# EAGLE board miniPET_final (EAGLE 9.6.2), part 1 of 2
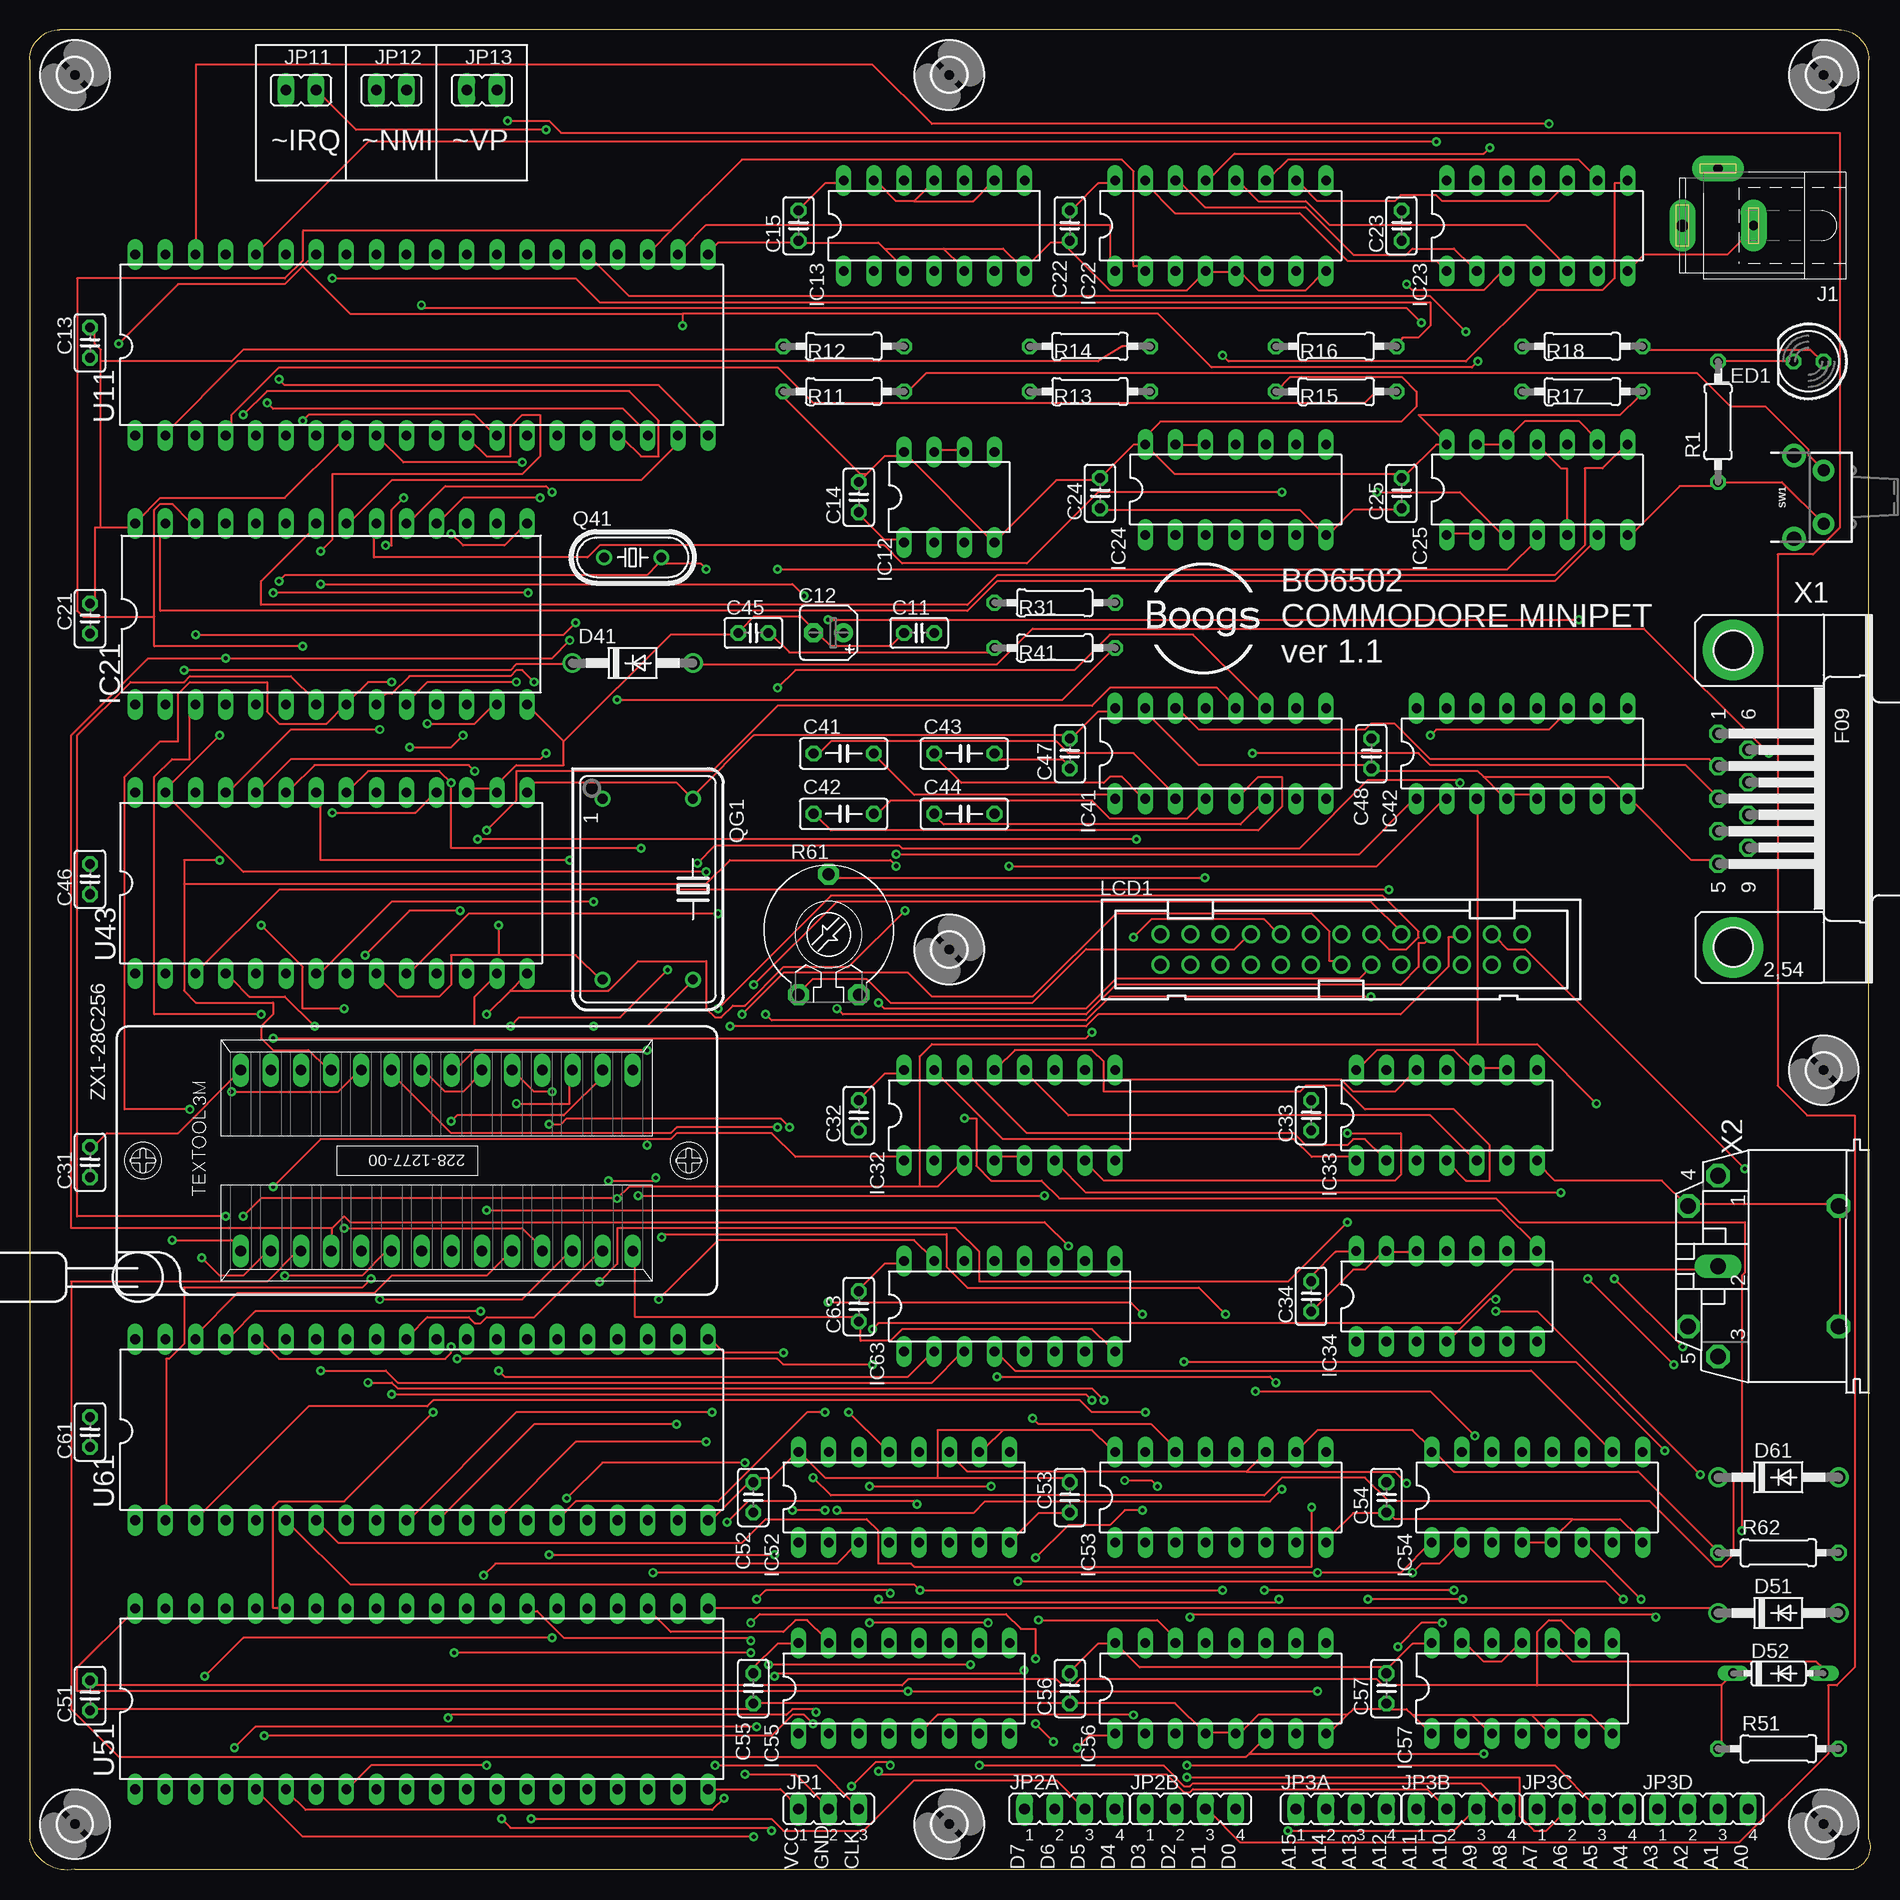
[diagram p7: board, top side]
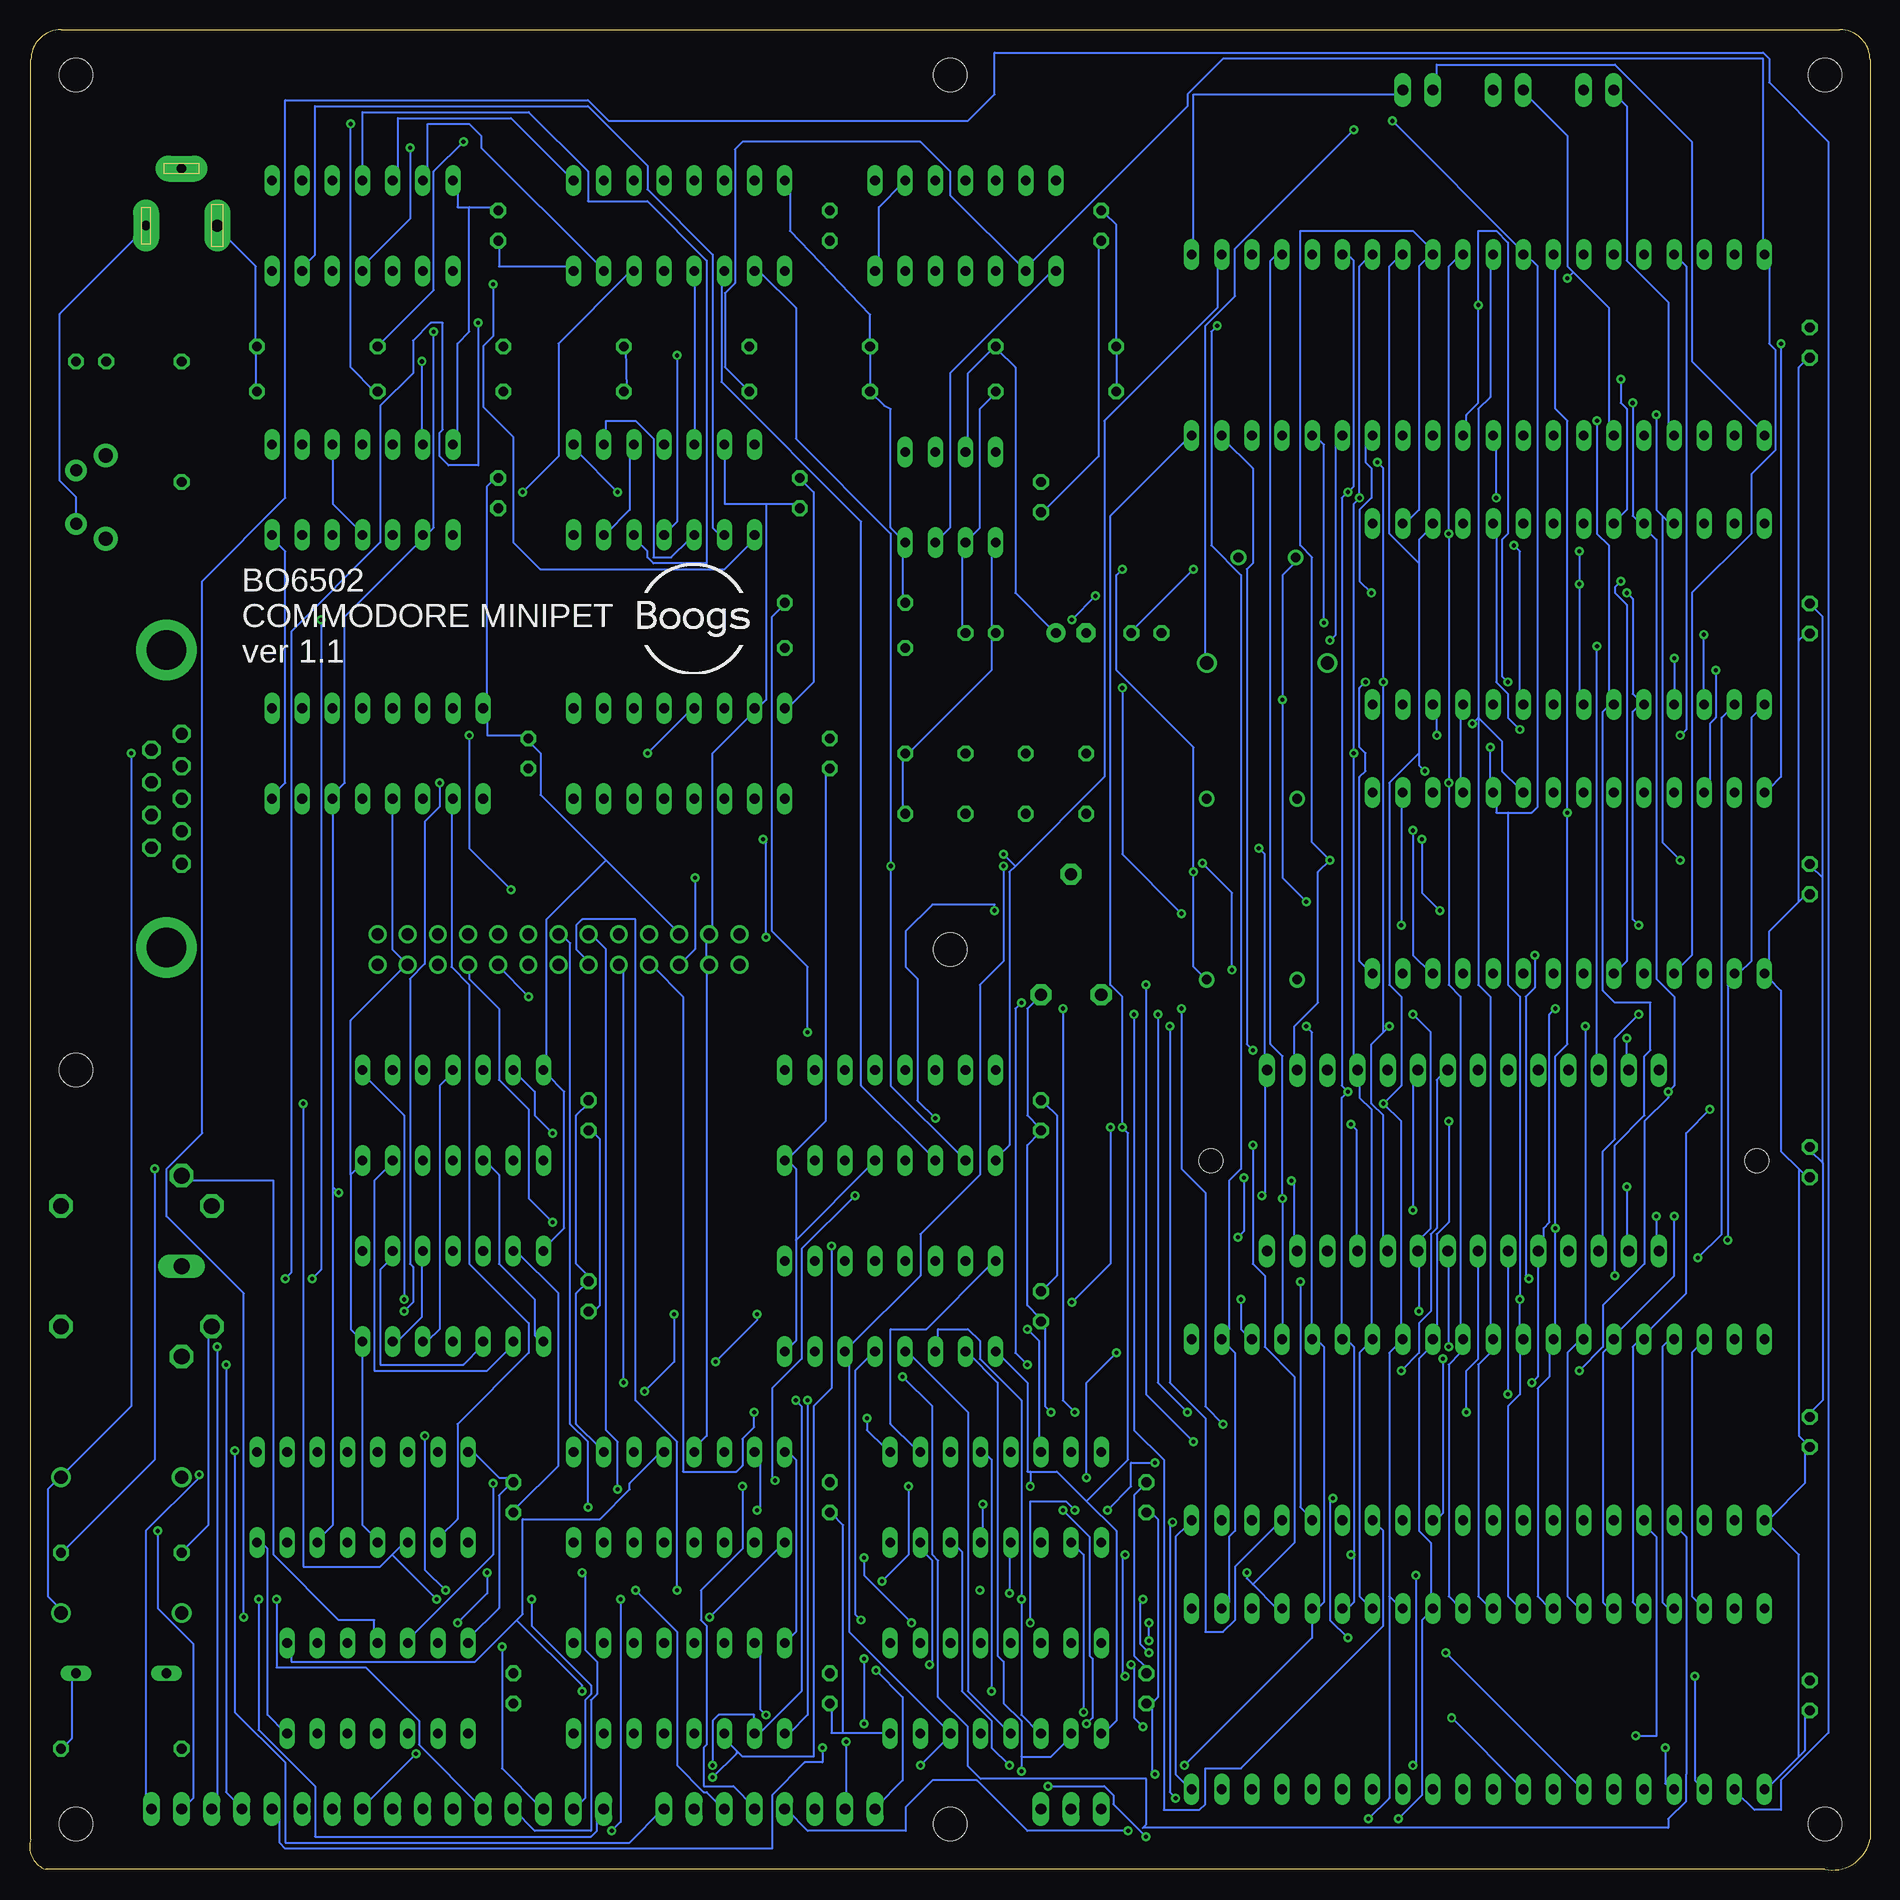
[diagram p8: board, bottom side, seen from below]

Size 155.04 x 155 mm. Coordinates in mm from the lower left corner, seen from the top.
Outline: 3.81,0.06 153.67,0.06 arc90 154.94,2.6 154.94,152.46 arc90 152.4,155 2.54,155 arc90 0,152.46 0,2.6 arc90 3.81,0.06
Copper layers (1*16): Top 0.035mm / dielectric 1.5mm / Bottom 0.035mm
Design rules "default": minimum track width 6mil, minimum drill 0.35mm, track to track 6mil, track to pad 6mil, pad to pad 6mil, via to via 6mil, smd to smd 6mil, copper to edge 40mil, drill to drill 6mil, minimum pad ring 10mil, minimum via ring 8mil, stop-mask expansion 4mil, vias tented up to drill 0mil, thermal gap 10mil

## Footprints (pad centres in the part's own frame; a part is rotated, then mirrored left to right if it is on the bottom)
C025-025X050 = drill 0.813 octagon: 1 -1.27,0; 2 1.27,0
B45181A = drill 0.813 pad 1.6: + -1.27,0 | drill 0.813 pad 1.6 octagon: - 1.27,0
C050-025X075 = drill 0.813 octagon: 1 -2.54,0; 2 2.54,0
DO41-10 = drill 1.118: A 5.08,0; C -5.08,0
DO35-7 = drill 0.813 long: A 3.81,0; C -3.81,0
DIL-08 = drill 0.813 long: 1 -3.81,-3.81; 2 -1.27,-3.81; 3 1.27,-3.81; 4 3.81,-3.81; 5 3.81,3.81; 6 1.27,3.81; 7 -1.27,3.81; 8 -3.81,3.81
DIL14 = drill 0.813 long: 1 -7.62,-3.81; 2 -5.08,-3.81; 3 -2.54,-3.81; 4 0,-3.81; 5 2.54,-3.81; 6 5.08,-3.81; 7 7.62,-3.81; 8 7.62,3.81; 9 5.08,3.81; 10 2.54,3.81; 11 0,3.81; 12 -2.54,3.81; 13 -5.08,3.81; 14 -7.62,3.81
DIL28-6 = drill 0.813 long: 1 -16.51,-7.62; 2 -13.97,-7.62; 3 -11.43,-7.62; 4 -8.89,-7.62; 5 -6.35,-7.62; 6 -3.81,-7.62; 7 -1.27,-7.62; 8 1.27,-7.62; 9 3.81,-7.62; 10 6.35,-7.62; 11 8.89,-7.62; 12 11.43,-7.62; 13 13.97,-7.62; 14 16.51,-7.62; 15 16.51,7.62; 16 13.97,7.62; 17 11.43,7.62; 18 8.89,7.62; 19 6.35,7.62; 20 3.81,7.62; 21 1.27,7.62; 22 -1.27,7.62; 23 -3.81,7.62; 24 -6.35,7.62; 25 -8.89,7.62; 26 -11.43,7.62; 27 -13.97,7.62; 28 -16.51,7.62
DIL16 = drill 0.813 long: 1 -8.89,-3.81; 2 -6.35,-3.81; 3 -3.81,-3.81; 4 -1.27,-3.81; 5 1.27,-3.81; 6 3.81,-3.81; 7 6.35,-3.81; 8 8.89,-3.81; 9 8.89,3.81; 10 6.35,3.81; 11 3.81,3.81; 12 1.27,3.81; 13 -1.27,3.81; 14 -3.81,3.81; 15 -6.35,3.81; 16 -8.89,3.81
SPC4078 = drill 0.8 pad 2.184 long: 1 -3,0; 2 0,-4.8 | drill 1 pad 2.184 long: 3 3,0
JP2 = drill 0.914 long: 1 -2.54,0; 2 0,0; 3 2.54,0
JP4 = drill 0.914 long: 1 -3.81,0; 2 -1.27,0; 3 1.27,0; 4 3.81,0
JP1 = drill 0.914 long: 1 0,-1.27; 2 0,1.27
PAK100/2500-26 = drill 1 pad 1.422: 1 -15.24,1.27; 2 -15.24,-1.27; 3 -12.7,1.27; 4 -12.7,-1.27; 5 -10.16,1.27; 6 -10.16,-1.27; 7 -7.62,1.27; 8 -7.62,-1.27; 9 -5.08,1.27; 10 -5.08,-1.27; 11 -2.54,1.27; 12 -2.54,-1.27; 13 0,1.27; 14 0,-1.27; 15 2.54,1.27; 16 2.54,-1.27; 17 5.08,1.27; 18 5.08,-1.27; 19 7.62,1.27; 20 7.62,-1.27; 21 10.16,1.27; 22 10.16,-1.27; 23 12.7,1.27; 24 12.7,-1.27; 25 15.24,1.27; 26 15.24,-1.27
LED5MM = drill 0.813 octagon: A -1.27,0; K 1.27,0
HC49/S = drill 0.813: 1 -2.413,0; 2 2.413,0
DIL14S = drill 0.813: 1 -7.62,-3.81; 7 7.62,-3.81; 8 7.62,3.81; 14 -7.62,3.81
0207/10 = drill 0.813 octagon: 1 -5.08,0; 2 5.08,0
PT-10 = drill 1.016 pad 1.778 octagon: 1 -2.54,-5.08; 2 2.54,-5.08; 3 0,5.08
TACTILE_SWITCH_PTH_RA_8-020 = drill 1 pad 1.8: 1 -2.25,0; 2 2.25,0 | drill 1.2 pad 2: M1 -3.5,2.5; M2 3.5,2.5
DIL40 = drill 0.813 long: 1 -24.13,-7.62; 2 -21.59,-7.62; 3 -19.05,-7.62; 4 -16.51,-7.62; 5 -13.97,-7.62; 6 -11.43,-7.62; 7 -8.89,-7.62; 8 -6.35,-7.62; 9 -3.81,-7.62; 10 -1.27,-7.62; 11 1.27,-7.62; 12 3.81,-7.62; 13 6.35,-7.62; 14 8.89,-7.62; 15 11.43,-7.62; 16 13.97,-7.62; 17 16.51,-7.62; 18 19.05,-7.62; 19 21.59,-7.62; 20 24.13,-7.62; 21 24.13,7.62; 22 21.59,7.62; 23 19.05,7.62; 24 16.51,7.62; 25 13.97,7.62; 26 11.43,7.62; 27 8.89,7.62; 28 6.35,7.62; 29 3.81,7.62; 30 1.27,7.62; 31 -1.27,7.62; 32 -3.81,7.62; 33 -6.35,7.62; 34 -8.89,7.62; 35 -11.43,7.62; 36 -13.97,7.62; 37 -16.51,7.62; 38 -19.05,7.62; 39 -21.59,7.62; 40 -24.13,7.62
DIL28 = drill 0.813 long: 1 -16.51,-7.62; 2 -13.97,-7.62; 3 -11.43,-7.62; 4 -8.89,-7.62; 5 -6.35,-7.62; 6 -3.81,-7.62; 7 -1.27,-7.62; 8 1.27,-7.62; 9 3.81,-7.62; 10 6.35,-7.62; 11 8.89,-7.62; 12 11.43,-7.62; 13 13.97,-7.62; 14 16.51,-7.62; 15 16.51,7.62; 16 13.97,7.62; 17 11.43,7.62; 18 8.89,7.62; 19 6.35,7.62; 20 3.81,7.62; 21 1.27,7.62; 22 -1.27,7.62; 23 -3.81,7.62; 24 -6.35,7.62; 25 -8.89,7.62; 26 -11.43,7.62; 27 -13.97,7.62; 28 -16.51,7.62
2,8 = hole 2.8: 0,0
F09HP = drill 1.016 octagon: 1 -5.486,-1.27; 2 -2.743,-1.27; 3 0,-1.27; 4 2.743,-1.27; 5 5.486,-1.27; 6 -4.115,1.27; 7 -1.372,1.27; 8 1.372,1.27; 9 4.115,1.27 | drill 3.302 pad 5.08: G1 -12.522,0; G2 12.522,0
MAB5SH = drill 1.321 octagon: 1 7.62,5.08; 3 -7.62,5.08; 4 5.08,7.62; 5 -5.08,7.62; PE -5.08,-5.08; PE@ 5.08,-5.08 | drill 1.321 long: 2 0,5.08
228-1277-00-0602J = drill 0.9 long: 1 -16.51,-7.62; 2 -13.97,-7.62; 3 -11.43,-7.62; 4 -8.89,-7.62; 5 -6.35,-7.62; 6 -3.81,-7.62; 7 -1.27,-7.62; 8 1.27,-7.62; 9 3.81,-7.62; 10 6.35,-7.62; 11 8.89,-7.62; 12 11.43,-7.62; 13 13.97,-7.62; 14 16.51,-7.62; 15 16.51,7.62; 16 13.97,7.62; 17 11.43,7.62; 18 8.89,7.62; 19 6.35,7.62; 20 3.81,7.62; 21 1.27,7.62; 22 -1.27,7.62; 23 -3.81,7.62; 24 -6.35,7.62; 25 -8.89,7.62; 26 -11.43,7.62; 27 -13.97,7.62; 28 -16.51,7.62 | hole 2: 21.24,0; -24.74,0

## Placement (x,y rotation side)
C11  100n  [C025-025X050]  74.93,104.2 0 top
C12  10uF  [B45181A]  67.31,104.2 180 top
C13  100n  [C025-025X050]  5.08,128.64 90 top
C14  100n  [C025-025X050]  69.85,115.63 90 top
C15  100n  [C025-025X050]  64.77,138.49 90 top
C21  100n  [C025-025X050]  5.08,105.41 90 top
C22  100n  [C025-025X050]  87.63,138.49 90 top
C23  100n  [C025-025X050]  115.57,138.49 90 top
C24  100n  [C025-025X050]  90.17,115.96 90 top
C25  100n  [C025-025X050]  115.57,115.96 90 top
C31  100n  [C025-025X050]  5.08,59.62 90 top
C32  100n  [C025-025X050]  69.85,63.56 90 top
C33  100n  [C025-025X050]  107.95,63.56 90 top
C34  100n  [C025-025X050]  107.95,48.32 90 top
C41  1u  [C050-025X075]  68.58,94.04 0 top
C42  1u  [C050-025X075]  68.58,88.96 0 top
C43  1u  [C050-025X075]  78.74,94.04 0 top
C44  1u  [C050-025X075]  78.74,88.96 0 top
C45  20p  [C025-025X050]  60.96,104.2 0 top
C46  100n  [C025-025X050]  5.08,83.46 90 top
C47  100n  [C025-025X050]  87.63,94.04 90 top
C48  100n  [C025-025X050]  113.03,94.04 90 top
C51  100n  [C025-025X050]  5.08,14.7 90 top
C52  100n  [C025-025X050]  60.96,31.39 90 top
C53  100n  [C025-025X050]  87.63,31.39 90 top
C54  100n  [C025-025X050]  114.3,31.39 90 top
C55  100n  [C025-025X050]  60.96,15.3 90 top
C56  100n  [C025-025X050]  87.63,15.3 90 top
C57  100n  [C025-025X050]  114.3,15.3 90 top
C61  100n  [C025-025X050]  5.08,36.89 90 top
C63  100n  [C025-025X050]  69.85,47.48 90 top
D41  BS140  [DO41-10]  50.8,101.66 0 top
D51  SB140  [DO41-10]  147.32,21.65 0 top
D52  1N4148  [DO35-7]  147.32,16.57 0 top
D61  SB140  [DO41-10]  147.32,33.08 0 top
IC12  NE555  [DIL-08]  77.47,115.63 0 top
IC13  74HCT04N  [DIL14]  76.2,138.49 0 top
IC21  HM62256  [DIL28-6]  25.4,105.79 0 top
IC22  74AC138N  [DIL16]  100.33,138.49 0 top
IC23  74HC08N  [DIL14]  127,138.49 0 top
IC24  74HC08N  [DIL14]  101.6,116.27 0 top
IC25  74HCT00N  [DIL14]  127,116.27 0 top
IC32  74AC138N  [DIL16]  82.55,63.56 0 top
IC33  74HC08N  [DIL14]  119.38,63.56 0 top
IC34  74HC08N  [DIL14]  119.38,48.32 0 top
IC41  MAX232  [DIL16]  100.33,94.04 0 top
IC42  74AC138N  [DIL16]  125.73,94.04 0 top
IC52  74HCT595N  [DIL16]  73.66,31.39 0 top
IC53  74HCT595N  [DIL16]  100.33,31.39 0 top
IC54  74AC138N  [DIL16]  127,31.39 0 top
IC55  74AC138N  [DIL16]  73.66,15.3 0 top
IC56  74AC138N  [DIL16]  100.33,15.3 0 top
IC57  74HCT14N  [DIL14]  125.73,15.3 0 top
IC63  74AC138N  [DIL16]  82.55,47.48 0 top
J1  POWER  [SPC4078]  142.24,138.49 180 top
JP1  [JP2]  67.31,5.14 0 top
JP2A  [JP4]  87.63,5.14 0 top
JP2B  [JP4]  97.79,5.14 0 top
JP3A  [JP4]  110.49,5.14 0 top
JP3B  [JP4]  120.65,5.14 0 top
JP3C  [JP4]  130.81,5.14 0 top
JP3D  [JP4]  140.97,5.14 0 top
JP11  [JP1]  22.86,149.92 90 top
JP12  [JP1]  30.48,149.92 90 top
JP13  [JP1]  38.1,149.92 90 top
LCD1  DS-G160128STBWW  [PAK100/2500-26]  110.49,77.53 0 top
LED1  RED  [LED5MM]  149.86,127.06 180 top
Q41  1.8432MHz  [HC49/S]  50.8,110.55 0 top
QG1  [DIL14S]  52.07,82.61 270 top
R1  330  [0207/10]  142.24,121.98 90 top
R11  1M  [0207/10]  68.58,124.52 180 top
R12  47k  [0207/10]  68.58,128.33 180 top
R13  1k  [0207/10]  89.32,124.52 180 top
R14  3.3K  [0207/10]  89.32,128.33 0 top
R15  3.3K  [0207/10]  110.07,124.52 0 top
R16  3.3K  [0207/10]  110.07,128.33 0 top
R17  3.3K  [0207/10]  130.81,124.52 0 top
R18  3.3K  [0207/10]  130.81,128.33 0 top
R31  330  [0207/10]  86.36,106.74 180 top
R41  1M  [0207/10]  86.36,102.93 180 top
R51  15K  [0207/10]  147.32,10.22 0 top
R61  10K  [PT-10]  67.31,78.8 0 top
R62  220  [0207/10]  147.32,26.73 0 top
SW1  MOMENTARY-SWITCH-SPST-PTH-RIGHT-ANGLE-8-020  [TACTILE_SWITCH_PTH_RA_8-020]  151.13,115.63 90 top
U11  65C02  [DIL40]  33.02,128.45 0 top
U43  65C51  [DIL28]  25.4,83.13 0 top
U51  65C22  [DIL40]  33.02,14.42 0 top
U61  65C22  [DIL40]  33.02,37.09 0 top
U$1  [2,8]  151.13,151.19 0 top
U$2  [2,8]  77.47,3.87 0 top
U$3  [2,8]  151.13,3.87 0 top
U$4  [2,8]  3.81,3.87 0 top
U$5  [2,8]  77.47,151.19 0 top
U$6  [2,8]  77.47,77.53 0 top
U$7  [2,8]  3.81,151.19 0 top
U$8  [2,8]  151.13,67.37 0 top
X1  RS232-DB9  [F09HP]  143.51,90.23 270 top
X2  DIN 5 pin  [MAB5SH]  147.32,50.86 90 top
ZX1-28C256  228-1277-00-0602J  [228-1277-00-0602J]  34.29,59.75 0 top